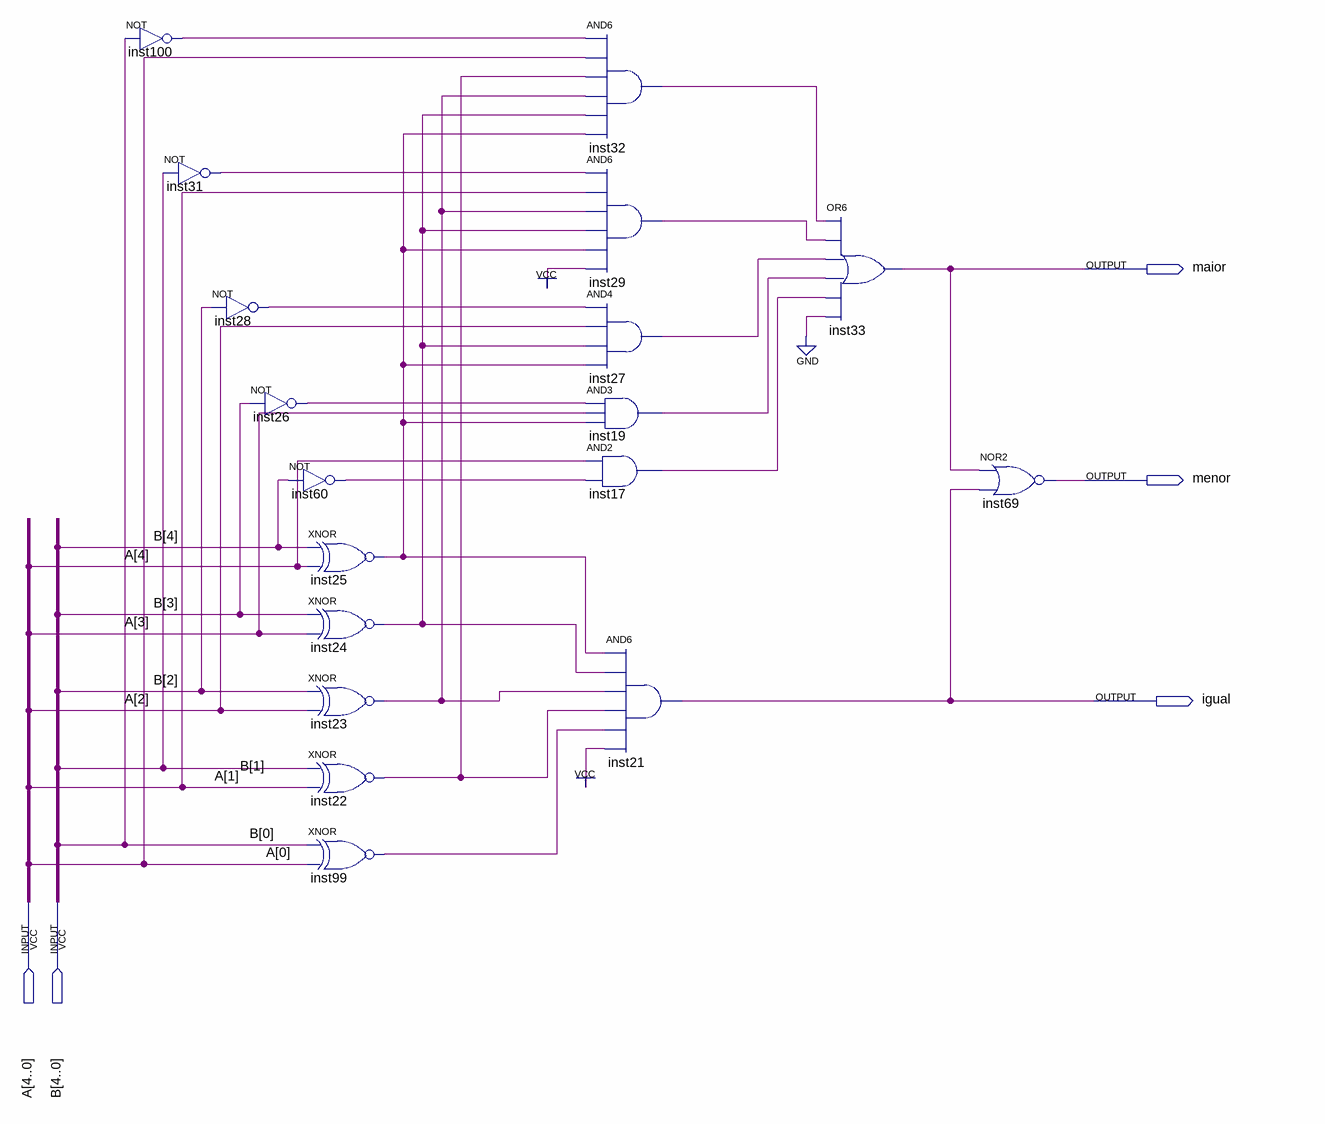
[diagram p0: schematic sheet]
// Quartus schematic comp_mag_unsigned.bdf as structural Verilog: 18 symbols, 5 pins
module comp_mag_unsigned (
  input  [4:0] A,
  input  [4:0] B,
  output maior,
  output menor,
  output igual
);

  wire inst17_out, inst19_out, inst22_out, inst23_out, inst24_out, inst25_out, inst26_out, inst27_out,
       inst28_out, inst29_out, inst31_out, inst32_out, inst60_out, inst99_out, inst100_out;

  not inst100 (inst100_out, B[0]);
  not inst31 (inst31_out, B[1]);
  not inst28 (inst28_out, B[2]);
  not inst26 (inst26_out, B[3]);
  not inst60 (inst60_out, B[4]);
  xnor inst25 (inst25_out, B[4], A[4]);
  xnor inst24 (inst24_out, B[3], A[3]);
  xnor inst23 (inst23_out, B[2], A[2]);
  xnor inst22 (inst22_out, B[1], A[1]);
  xnor inst99 (inst99_out, B[0], A[0]);
  and inst32 (inst32_out, inst100_out, A[0], inst22_out, inst23_out, inst24_out, inst25_out);
  and inst29 (inst29_out, inst31_out, A[1], inst23_out, inst24_out, inst25_out, 1'b1);
  and inst27 (inst27_out, inst28_out, A[2], inst24_out, inst25_out);
  and inst19 (inst19_out, inst26_out, A[3], inst25_out);
  and inst17 (inst17_out, A[4], inst60_out);
  and inst21 (igual, inst25_out, inst24_out, inst23_out, inst22_out, inst99_out, 1'b1);
  or inst33 (maior, inst32_out, inst29_out, inst27_out, inst19_out, inst17_out, 1'b0);
  nor inst69 (menor, maior, igual);
endmodule
